# Altium schematic sheet Base_USB_Camera.SchDoc
size B; SheetNumber: 3; SheetTotal: 4
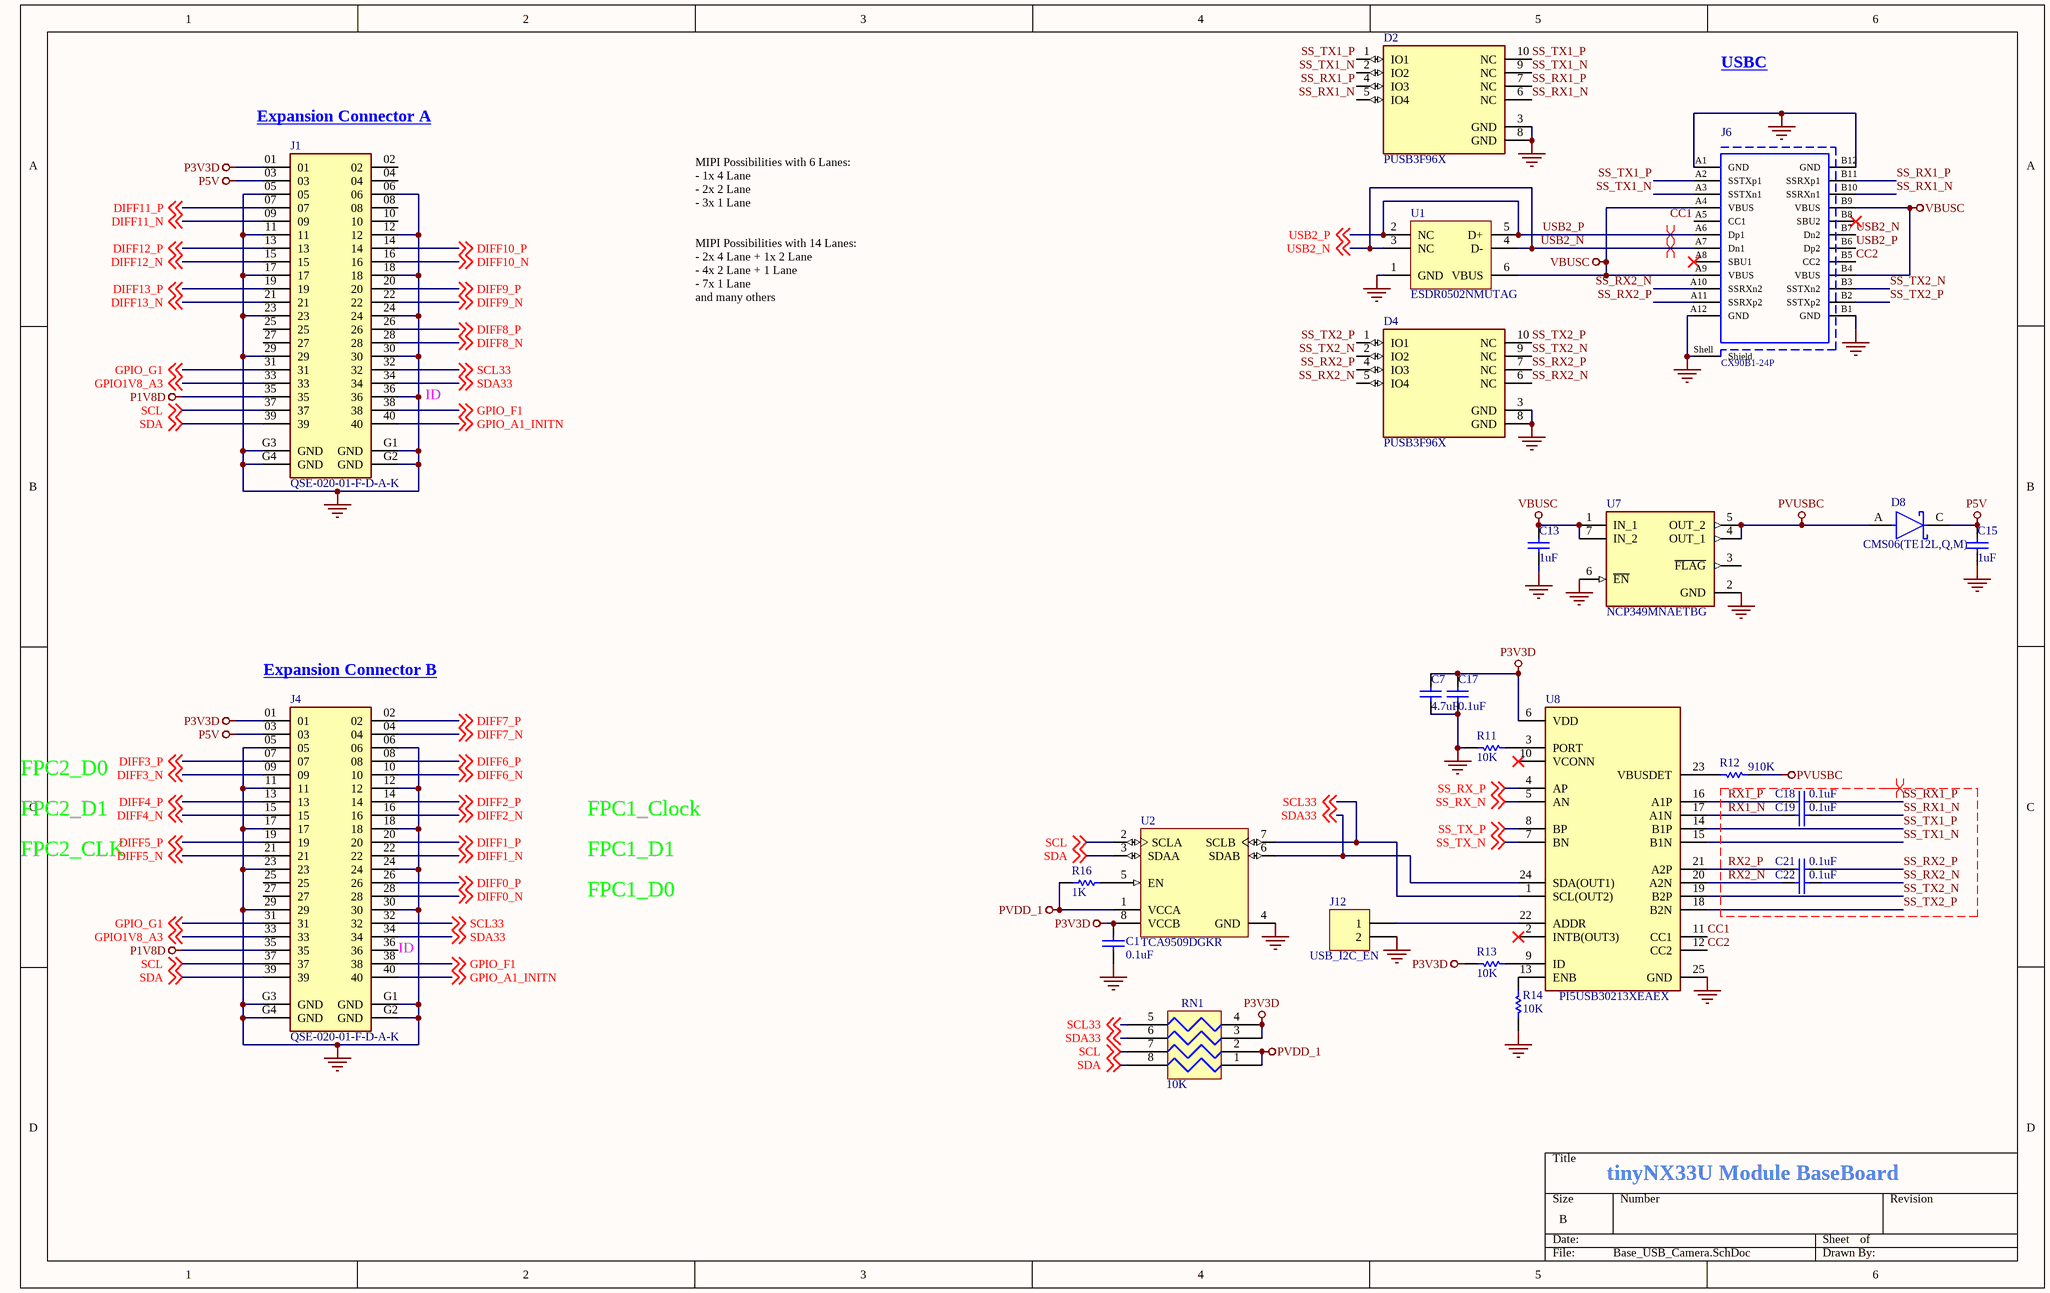
[diagram p0: Base_USB_Camera.SchDoc]

## Parts
C1  0.1uF  [CAPC1005X55USR]
C7  4.7uF  [CAPC1005X55USR]
C13  1uF  [CAPC1005X55USR]
C15  1uF  [CAPC1005X55USR]
C17  0.1uF  [CAPC1005X55USR]
C18  0.1uF  [CAPC1005X55USR]
C19  0.1uF  [CAPC1005X55USR]
C21  0.1uF  [CAPC1005X55USR]
C22  0.1uF  [CAPC1005X55USR]
D2  PUSB3F96X  [DFN2510A-10]
D4  PUSB3F96X  [DFN2510A-10]
D8  CMS06(TE12L,Q,M)  [SOD-128]
J1  QSE-020-01-F-D-A-K  [SAMTEC_QSE-020-01-XXX-D-A-L]
J4  QSE-020-01-F-D-A-K  [SAMTEC_QSE-020-01-XXX-D-A-L]
J6  CX90B1-24P  [HRS_CX90B1-24P]
J12  Content: USB_I2C_EN  [HDR2X1_MALE_2.54MM]  (hidden comment: Header 2X1_2.54MM)
R11  10K  [RESC1005X40USR]
R12  910K  [RESC1005X40USR]
R13  10K  [RESC1005X40USR]
R14  10K  [RESC1005X40USR]
R16  1K  [RESC1005X40USR]
RN1  10K  [RESCAXS50P100X200X45-8NA]
U1  ESDR0502NMUTAG  [ONSC-UDFN-6-517AA-01_V]
U2  TCA9509DGKR  [SOP65P490X110-8N]
U7  NCP349MNAETBG  [SON50P200X160X100-7N-D]
U8  PI5USB30213XEAEX  [QFN40P400X200X50-25N]

## Nets
GND: C1.1 C7.1 C13.1 C15.1 C17.1 D2.3(GND) D2.8(GND) D4.3(GND) D4.8(GND) J1.05 J1.06 J1.11 J1.12 J1.17 J1.18 J1.23 J1.24 J1.29 J1.30 J1.36 J1.G1(GND) J1.G2(GND) J1.G3(GND) J1.G4(GND) J4.05 J4.06 J4.11 J4.12 J4.17 J4.18 J4.23 J4.24 J4.29 J4.30 J4.G1(GND) J4.G2(GND) J4.G3(GND) J4.G4(GND) J6.A1(GND) J6.A12(GND) J6.B1(GND) J6.B12(GND) J6.Shell(Shield) J12.2 R11.1 R14.2 U1.1(GND) U2.4(GND) U7.2(GND) U7.6(~{EN}) U8.25(GND)
P1V8D: J1.35 J4.35
P3V3D: C1.2 C7.2 C17.2 J1.01 J4.01 R13.1 RN1.3 RN1.4 U2.8(VCCB) U8.6(VDD)
P5V: C15.2 D8.C J1.03 J4.03
PVDD_1: R16.1 RN1.1 RN1.2 U2.1(VCCA)
PVUSBC: D8.A R12.2 U7.4(OUT_1) U7.5(OUT_2)
VBUSC: C13.2 J6.A4(VBUS) J6.A9(VBUS) J6.B4(VBUS) J6.B9(VBUS) U1.6(VBUS) U7.1(IN_1) U7.7(IN_2)
CC1: J6.A5(CC1) U8.11(CC1)
CC2: J6.B5(CC2) U8.12(CC2)
DIFF0_N: J4.28 ; off-sheet DIFF0_N
DIFF0_P: J4.26 ; off-sheet DIFF0_P
DIFF1_N: J4.22 ; off-sheet DIFF1_N
DIFF1_P: J4.20 ; off-sheet DIFF1_P
DIFF2_N: J4.16 ; off-sheet DIFF2_N
DIFF2_P: J4.14 ; off-sheet DIFF2_P
DIFF3_N: J4.09 ; off-sheet DIFF3_N
DIFF3_P: J4.07 ; off-sheet DIFF3_P
DIFF4_N: J4.15 ; off-sheet DIFF4_N
DIFF4_P: J4.13 ; off-sheet DIFF4_P
DIFF5_N: J4.21 ; off-sheet DIFF5_N
DIFF5_P: J4.19 ; off-sheet DIFF5_P
DIFF6_N: J4.10 ; off-sheet DIFF6_N
DIFF6_P: J4.08 ; off-sheet DIFF6_P
DIFF7_N: J4.04 ; off-sheet DIFF7_N
DIFF7_P: J4.02 ; off-sheet DIFF7_P
DIFF8_N: J1.28 ; off-sheet DIFF8_N
DIFF8_P: J1.26 ; off-sheet DIFF8_P
DIFF9_N: J1.22 ; off-sheet DIFF9_N
DIFF9_P: J1.20 ; off-sheet DIFF9_P
DIFF10_N: J1.16 ; off-sheet DIFF10_N
DIFF10_P: J1.14 ; off-sheet DIFF10_P
DIFF11_N: J1.09 ; off-sheet DIFF11_N
DIFF11_P: J1.07 ; off-sheet DIFF11_P
DIFF12_N: J1.15 ; off-sheet DIFF12_N
DIFF12_P: J1.13 ; off-sheet DIFF12_P
DIFF13_N: J1.21 ; off-sheet DIFF13_N
DIFF13_P: J1.19 ; off-sheet DIFF13_P
GPIO1V8_A3: J1.33 J4.33 ; off-sheet GPIO1V8_A3
GPIO_A1_INITN: J1.40 J4.40 ; off-sheet GPIO_A1_INITN
GPIO_F1: J1.38 J4.38 ; off-sheet GPIO_F1
GPIO_G1: J1.31 J4.31 ; off-sheet GPIO_G1
RX1_N: C19.1 U8.17(A1N)
RX1_P: C18.1 U8.16(A1P)
RX2_N: C22.1 U8.20(A2N)
RX2_P: C21.1 U8.21(A2P)
SCL: J1.37 J4.37 RN1.7 U2.2(SCLA) ; off-sheet SCL
SCL33: J1.32 J4.32 RN1.5 U2.7(SCLB) U8.1(SCL(OUT2)) ; off-sheet SCL33
SDA: J1.39 J4.39 RN1.8 U2.3(SDAA) ; off-sheet SDA
SDA33: J1.34 J4.34 RN1.6 U2.6(SDAB) U8.24(SDA(OUT1)) ; off-sheet SDA33
SS_RX1_N: C19.2 D2.5(IO4) D2.6(NC) J6.B10(SSRXn1)
SS_RX1_P: C18.2 D2.4(IO3) D2.7(NC) J6.B11(SSRXp1)
SS_RX2_N: C22.2 D4.5(IO4) D4.6(NC) J6.A10(SSRXn2)
SS_RX2_P: C21.2 D4.4(IO3) D4.7(NC) J6.A11(SSRXp2)
SS_RX_N: U8.5(AN) ; off-sheet SS_RX_N
SS_RX_P: U8.4(AP) ; off-sheet SS_RX_P
SS_TX1_N: D2.2(IO2) D2.9(NC) J6.A3(SSTXn1) U8.15(B1N)
SS_TX1_P: D2.1(IO1) D2.10(NC) J6.A2(SSTXp1) U8.14(B1P)
SS_TX2_N: D4.2(IO2) D4.9(NC) J6.B3(SSTXn2) U8.19(B2P)
SS_TX2_P: D4.1(IO1) D4.10(NC) J6.B2(SSTXp2) U8.18(B2N)
SS_TX_N: U8.7(BN) ; off-sheet SS_TX_N
SS_TX_P: U8.8(BP) ; off-sheet SS_TX_P
USB2_N: J6.A7(Dn1) J6.B7(Dn2) U1.3(NC) U1.4(D-) ; off-sheet USB2_N
USB2_P: J6.A6(Dp1) J6.B6(Dp2) U1.2(NC) U1.5(D+) ; off-sheet USB2_P
NetJ12_1: J12.1 U8.22(ADDR)
NetR11_2: R11.2 U8.3(PORT)
NetR12_1: R12.1 U8.23(VBUSDET)
NetR13_2: R13.2 U8.9(ID)
NetR14_1: R14.1 U8.13(ENB)
NetR16_2: R16.2 U2.5(EN)

Not connected (* = marked no-connect by the designer): J1 02 04 08 10 25 27; J4 25 27 36; J6 A8(SBU1)* B8(SBU2)*; U7 3(~{FLAG}); U8 2(INTB(OUT3))* 10(VCONN)*

## Layout directives
differential pair: RX1_N, RX1_P, RX2_N, RX2_P, SS_RX1_N, SS_RX1_P, SS_RX2_N, SS_RX2_P, SS_TX1_N, SS_TX1_P, SS_TX2_N, SS_TX2_P, USB2_N, USB2_P

## Notes on the sheet
- USBC
- (near J1) Expansion Connector A
- MIPI Possibilities with 6 Lanes:
  - 1x 4 Lane
  - 2x 2 Lane
  - 3x 1 Lane
- MIPI Possibilities with 14 Lanes:
  - 2x 4 Lane + 1x 2 Lane
  - 4x 2 Lane + 1 Lane
  - 7x 1 Lane
  and many others
- ID
- (near J4) Expansion Connector B
- FPC2_D0
- FPC2_D1
- FPC1_Clock
- FPC2_CLK
- FPC1_D1
- FPC1_D0
- (near J4) ID
- tinyNX33U Module BaseBoard

## Library data of the parts
C1 C17-C19 C21 C22 = CAP CER 0.1UF 16V X7R 0402: Manufacturer Part Number: CGA2B1X7R1C104K050BC; Manufacturer: TDK Corporation; Supplier Part Number 1: 445-5613-2-ND; Package: 0402; Height: 0.55mm; Supplier 1: Digi-Key; value: 0.1uF
C7 = CAP CER 4.7UF 10V X5R 0402: Manufacturer Part Number: C1005X5R1A475M050BC; Manufacturer: TDK Corporation; Supplier Part Number 1: 445-8023-1-ND; Package: 0402; value: 4.7uF; Supplier 1: Digi-Key; Height: 0.55mm; ComponentLink1Description: New link; ComponentLink1URL: *
C13 C15 = CAP CER 1UF 25V X5R 0402: Manufacturer Part Number: GRM155R61E105MA12D; Manufacturer: Murata Electronics; Part #: E-CAP-042; value: 1uF; Supplier Part Number 1: 490-10018-1-ND; Package: 0402; Supplier 1: Digi-Key; Height: 0.55mm; ComponentLink1Description: New link; ComponentLink1URL: *
D2 D4 = PUSB3F96X: TVS DIODE 5.5VWM 4.6VC DFN2510A; Manufacturer: Nexperia USA Inc.; Interface: USB; Manufacturer Part Number: PUSB3F96X; Supplier 1: Digi-Key; Supplier Part Number 1: 1727-2030-1-ND
D8 = D_CMS06(TE12L,Q,M): Rectifier Diode Schottky 30V 2A 2-Pin M-FLAT T/R; Manufacturer: Toshiba; Forward Voltage: 370mV; Peak Non-Repetitive Surge Current: 40A; Max Reverse Leakage Current: 3mA; Element Configuration: Single; Package Quantity: 1; Max Operating Temperature: 125°C; Mount: Surface Mount; Max Repetitive Reverse Voltage (Vrrm): 30V; Forward Current: 2A; Number of Pins: 2; Min Operating Temperature: -40°C; Radiation Hardening: No; Average Rectified Current: 2A; Contact Plating: Tin,Silver; Max Reverse Voltage (DC): 30V; Max Surge Current: 40A; Packaging: Tape and Reel; Supplier 1: Digi-Key; Manufacturer Part Number: CMS06(TE12L,Q,M); RoHS: No; Category: Rectifier Diodes; Stock 1: 49976; Pricing 1: 1=0.56000, 10=0.48200, 100=0.35950, 500=0.28248, 1000=0.21828 (USD); Max Reverse Current: 3mA; Series: -; RoHS Compliant: No; ComponentLink1URL: https://datasheet.ciiva.com/916/dst-cms06-tde-en-1613-916722.pdf?src-supplier=Digi-Key; ComponentLink1Description: https://datasheet.ciiva.com/916/dst-cms06-tde-en-1613-916722.pdf?src-supplier=Digi-Key; ComponentLink2URL: https://datasheet.ciiva.com/916/dst-cms06-tde-en-1613-916723.pdf?src-supplier=Digi-Key; ComponentLink2Description: https://datasheet.ciiva.com/916/dst-cms06-tde-en-1613-916723.pdf?src-supplier=Digi-Key; ComponentLink3URL: https://datasheet.ciiva.com/8281/cms06-datasheet-en-20131101-8281819.pdf?src-supplier=Avnet; ComponentLink3Description: https://datasheet.ciiva.com/8281/cms06-datasheet-en-20131101-8281819.pdf?src-supplier=Avnet; Supplier Part Number 1: CMS06QMCT-ND
J1 J4 = QSE-020-01-F-D-A-K: Q Strip® High-Speed Ground Plane Header, 0.80mm Pitch; Manufacturer: Samtec; Manufacturer Part Number: QTE-020-01-F-D-A; Number of Positions: 40; Gender: Male; Pitch: 0.031inch; Mated Stacking Heights: 5mm; Supplier 1: Digi-Key; Supplier Part Number 1: SAM8846-ND; RoHS: Yes; Category: Board to Board Connectors; Stock: 1329; Pricing: 1=9.48000, 10=8.53000, 25=8.03560, 40=7.82950, 96=7.62344, 288=6.79931, 480=6.38725, 960=5.64550 (USD); Mounting Technology: Surface Mount; Contact Plating: Gold; Number of Rows: 2; Packaging: Tray; Termination: Solder; Number of Contacts: 40; Series: QStrip® QTE; Package Quantity: 1; RoHS Compliant: Yes; ComponentLink1URL: https://datasheet.ciiva.com/6924/qte-xxx-xx-x-d-xxx-mkt-6924765.pdf?src-supplier=Digi-Key; ComponentLink1Description: https://datasheet.ciiva.com/6924/qte-xxx-xx-x-d-xxx-mkt-6924765.pdf?src-supplier=Digi-Key
J6 = USB 3.1_HRS_CX90B1-24P: CONN RCP USB3.1 TYPEC 24P SMD RA; Manufacturer: Hirose Electric Co Ltd; Number of Contacts: 24; Supplier 1: Digi-Key; Supplier Part Number 1: H125778CT-ND; Manufacturer Part Number: CX90B1-24P; ComponentLink1URL: https://www.mouser.com/ds/2/445/632723x00011-782157.pdf?src-supplier=Mouser; ComponentLink1Description: https://www.mouser.com/ds/2/445/632723x00011-782157.pdf?src-supplier=Mouser; ComponentLink2URL: https://katalog.we-online.de/em/datasheet/632723x00011.pdf?src-supplier=Digi-Key; ComponentLink2Description: https://katalog.we-online.de/em/datasheet/632723x00011.pdf?src-supplier=Digi-Key
J12 = Header 2X1_2.54MM: Conn Header Vert 2POS 2.54MM; Manufacturer: Sullins; Manufacturer Part Number: PRPC002SAAN-RC; Number of Positions: 2; Pitch: 0.1inch; Supplier 1: Digi-Key; Supplier Part Number 1: S1011EC-02-ND; RoHS: Yes; Category: Connectors; Stock: 31528; Pricing: 1=0.08000, 10=0.07300, 25=0.05400, 50=0.04640, 100=0.04490, 250=0.03872, 500=0.03716 (USD); Mounting Technology: Through Hole; Color: Black; Contact Plating: Gold; Package Quantity: 1; Number of Rows: 1; Packaging: Bulk; Termination: Solder; Series: -; Contact Type: Male Pin; Contact Mating Length: 0.23inch; RoHS Compliant: Yes; ComponentLink1URL: https://datasheet.ciiva.com/741/xrxczzzsxxn-rc-st-11635-b-741243.pdf?src-supplier=Digi-Key; ComponentLink1Description: https://datasheet.ciiva.com/741/xrxczzzsxxn-rc-st-11635-b-741243.pdf?src-supplier=Digi-Key
R11 R13 R14 = RES SMD 10K OHM 1% 1/16W 0402: Manufacturer: Samsung Electro-Mechanics; Manufacturer Part Number: RC1005F103CS; Supplier Part Number 1: 1276-3431-2-ND; Package: 0402; Height: 0.4mm; Supplier 1: Digi-Key; value: 10K
R12 = RES 910K OHM 1% 1/16W 0402: Manufacturer: YAGEO; Manufacturer Part Number: RC0402FR-07910KL; Supplier Part Number 1: YAG3257CT-ND; Package: 0402; Height: 0.4mm; Supplier 1: Digi-Key; value: 910K
R16 = RES 1K OHM 1% 1/16W 0402: RES SMD 1K OHM 1% 1/16W 0402; Manufacturer: YAGEO; Manufacturer Part Number: RC0402FR-071KL; Supplier Part Number 1: 311-1.00KLRCT-ND; Package: 0402; Height: 0.4mm; Supplier 1: Digi-Key; value: 1K
RN1 = RES ARRAY 4 RES 47K OHM 0804: Res Thick Film Array 10K Ohm 5% ±200ppm/°C ISOL 8-Pin 0804(4 X 0402) Convex SMD Automotive T/R; Manufacturer: Panasonic; Manufacturer Part Number: EXB-28V103JX; Number of Resistors: 4; Power Dissipation: 63mW; Voltage Rating: 50V; Circuit Type: Isolated; Power Per Element: 62.5mW; Number of Contacts: 8; Voltage Rating (DC): 100V; Supplier 1: Digi-Key; Supplier Part Number 1: Y7103CT-ND; RoHS: Yes; Category: Resistor Arrays; Stock: 1570078; Pricing: 1=0.10000, 10=0.08100, 25=0.05640, 50=0.04380, 100=0.03130, 250=0.02444, 500=0.01942, 1000=0.01378, 5000=0.01065 (USD); Mounting Technology: Surface Mount; Case/Package: 0804; Pins: 8; Case Code (Metric): 1005; Case Code (Imperial): 0402; Min Operating Temperature: -55°C; Max Operating Temperature: 125°C; Value: 10K; Packaging: Tape and Reel; Package Quantity: 1; Temperature Coefficient: 200ppm/°C; Series: EXB; Tolerance: 5%; Number of Elements: 4; Termination: Convex; Resistance Tolerance: 5%; Technology: THICK FILM; Length: 2mm; Width: 1mm; Height: 0.35mm; Depth: 1mm; Terminal Pitch: 0.5mm; Radiation Hardening: No; Lead Free: Lead Free; RoHS Compliant: Yes; Military Standard: Not; Reach SVHC Compliant: Unknown; ComponentLink1URL: https://datasheet.ciiva.com/46387/1480003-46387949.pdf?src-supplier=Element14; ComponentLink1Description: https://datasheet.ciiva.com/46387/1480003-46387949.pdf?src-supplier=Element14; ComponentLink2URL: https://datasheet.ciiva.com/46376/1480003-46376265.pdf?src-supplier=Element14; ComponentLink2Description: https://datasheet.ciiva.com/46376/1480003-46376265.pdf?src-supplier=Element14; ComponentLink3URL: https://datasheet.ciiva.com/28418/1790599-28418558.pdf?src-supplier=Element14; ComponentLink3Description: https://datasheet.ciiva.com/28418/1790599-28418558.pdf?src-supplier=Element14; ComponentLink4URL: https://datasheet.ciiva.com/28636/1790599-28636885.pdf?src-supplier=Element14; ComponentLink4Description: https://datasheet.ciiva.com/28636/1790599-28636885.pdf?src-supplier=Element14; ComponentLink5URL: https://datasheet.ciiva.com/30209/aoc0000ce1-30209125.pdf?src-supplier=Onlinecomponents.com; ComponentLink5Description: https://datasheet.ciiva.com/30209/aoc0000ce1-30209125.pdf?src-supplier=Onlinecomponents.com
U1 = ONSC-ESDR0502N-UDFN-6-517AA-01: TVS DIODE 5.5VWM 6UDFN; Manufacturer: ON Semiconductor; ComponentLink2URL: http://www.onsemi.cn/pub_link/Collateral/ESDR0502N-D.PDF; ComponentLink3URL: http://www.onsemi.com/pub_link/Collateral/517AA.PDF; ComponentLink1Description: Manufacturer URL; ComponentLink2Description: Datasheet; ComponentLink3Description: Package Specification; ComponentLink1URL: http://www.onsemi.com/; Supplier Part Number 1: 863-ESDR0502NMUTAG; Manufacturer Part Number: ESDR0502NMUTAG; Supplier 1: Mouser
U2 = TI-TCA9509-MSOP_DGK-8: Level-translating I2C And Smbus; Manufacturer: Texas Instruments; Min Supply Voltage: 900mV; Max Supply Voltage: 5.5V; Propagation Delay: 132.8ns; Clock Frequency: 400kHz; Number of Outputs: 2; Input: 2-Wire Bus; Number of Channels: 1; Operating Supply Current: 3mA; Supplier 1: Digi-Key; Supplier Part Number 1: 296-30283-1-ND; Manufacturer Part Number: TCA9509DGKR; RoHS: Yes; Category: Interface ICs; Stock: 68069; Pricing: 1=1.27000, 10=1.13200, 25=1.07480, 100=0.88270, 250=0.82516, 500=0.72922, 1000=0.57570 (USD); Case/Package: VSSOP; Pins: 8; Weight: 0.001058oz; Min Operating Temperature: -40°C; Max Operating Temperature: 85°C; Packaging: Tape and Reel; Series: -; Length: 3.1mm; Width: 3.1mm; Height: 0.95mm; Radiation Hardening: No; Reach SVHC Compliant: No; Lead Free: Lead Free; RoHS Compliant: Yes; ComponentLink1URL: https://datasheet.ciiva.com/22791/tca9509-22791264.pdf?src-supplier=Farnell; ComponentLink1Description: https://datasheet.ciiva.com/22791/tca9509-22791264.pdf?src-supplier=Farnell; ComponentLink2URL: https://datasheet.ciiva.com/3149/tca9509-3149522.pdf?src-supplier=Avnet; ComponentLink2Description: https://datasheet.ciiva.com/3149/tca9509-3149522.pdf?src-supplier=Avnet; ComponentLink3URL: https://datasheet.ciiva.com/26911/getdatasheetpartid-476504-26911504.pdf?src-supplier=Verical; ComponentLink3Description: https://datasheet.ciiva.com/26911/getdatasheetpartid-476504-26911504.pdf?src-supplier=Verical; ComponentLink4URL: https://datasheet.ciiva.com/41460/001187989-da-01-en-ic-i2c-bus-rep-l-tca9509dgkr-vssop-8-tid-41460370.pdf?src-supplier=Conrad; ComponentLink4Description: https://datasheet.ciiva.com/41460/001187989-da-01-en-ic-i2c-bus-rep-l-tca9509dgkr-vssop-8-tid-41460370.pdf?src-supplier=Conrad; ComponentLink5URL: https://datasheet.ciiva.com/1784/tca9509-1784225.pdf?src-supplier=Digi-Key; ComponentLink5Description: https://datasheet.ciiva.com/1784/tca9509-1784225.pdf?src-supplier=Digi-Key; ComponentLink6URL: https://datasheet.ciiva.com/1784/tca9509-1784226.pdf?src-supplier=Digi-Key; ComponentLink6Description: https://datasheet.ciiva.com/1784/tca9509-1784226.pdf?src-supplier=Digi-Key; ComponentLink7URL: https://datasheet.ciiva.com/1784/tca9509-1784227.pdf?src-supplier=Digi-Key; ComponentLink7Description: https://datasheet.ciiva.com/1784/tca9509-1784227.pdf?src-supplier=Digi-Key
U7 = NCP349MNAETBG: IC CTLR OVP 28V W/NMOS 6-DFN; Manufacturer: ON Semiconductor; Min Supply Voltage: 1.2V; Operating Supply Current: 70uA; Height: 0.95mm; Supplier 1: Digi-Key; Manufacturer Part Number: NCP349MNAETBG; RoHS: Yes; Category: Power Management ICs; Stock 1: 1255; Pricing 1: 1=0.96000, 10=0.84700, 25=0.79520, 100=0.64900, 250=0.60284, 500=0.51304, 1000=0.41043 (USD); Mount: Surface Mount; Case/Package: DFN; Number of Pins: 6; Weight: 0.000744oz; Min Operating Temperature: -40°C; Max Operating Temperature: 85°C; Packaging: Tape and Reel; Package Quantity: 3000; Max Supply Voltage: 28V; Series: -; Length: 2mm; Width: 1.6mm; Reach SVHC Compliant: Yes; Lead Free: Lead Free; Halogen Free: Halogen Free; RoHS Compliant: Yes; ComponentLink1URL: https://datasheet.ciiva.com/1967/ncp349-d-1967888.pdf?src-supplier=Avnet; ComponentLink1Description: https://datasheet.ciiva.com/1967/ncp349-d-1967888.pdf?src-supplier=Avnet; ComponentLink2URL: https://datasheet.ciiva.com/6602/ncp349-d-6602421.pdf?src-supplier=Digi-Key; ComponentLink2Description: https://datasheet.ciiva.com/6602/ncp349-d-6602421.pdf?src-supplier=Digi-Key; ComponentLink3URL: https://datasheet.ciiva.com/6602/ncp349-d-6602425.pdf?src-supplier=Digi-Key; ComponentLink3Description: https://datasheet.ciiva.com/6602/ncp349-d-6602425.pdf?src-supplier=Digi-Key; Supplier Part Number 1: NCP349MNAETBGOSCT-ND
U8 = PI5USB30213XEAEX: USB Power SW DIST Single 2.7V to 5.5V 1.5A/3A 24-Pin TQFN T/R; Manufacturer: Diodes; Supplier 1: Digi-Key; Supplier Part Number 1: PI5USB30213XEAEXCT-ND; Manufacturer Part Number: PI5USB30213XEAEX; RoHS: Yes; Category: Power Management ICs; Stock: 3456; Pricing: 1=1.92000, 10=1.72200, 25=1.62480, 100=1.38450, 250=1.30000, 500=1.13750, 1000=0.94250 (USD); RoHS Compliant: Yes; ComponentLink1URL: https://media.digikey.com/pdf/Data%20Sheets/Pericom%20PDFs/PI5USB30213_Web.pdf?src-supplier=Digi-Key; ComponentLink1Description: https://media.digikey.com/pdf/Data%20Sheets/Pericom%20PDFs/PI5USB30213_Web.pdf?src-supplier=Digi-Key